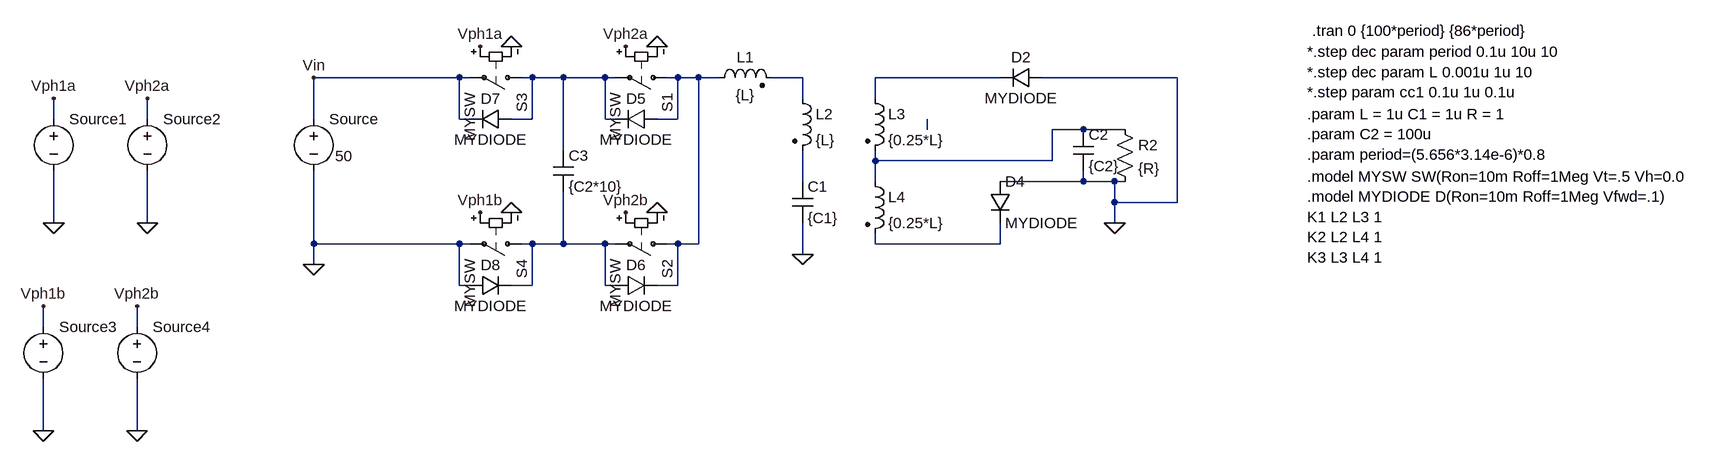
[diagram p0: schematic LLC_multilevel.asc]
LLC_multilevel.asc, the LTspice schematic file:
Version 4
SHEET 1 1688 680
WIRE -448 96 -672 96
WIRE -432 96 -448 96
WIRE -336 96 -352 96
WIRE -288 96 -336 96
WIRE -224 96 -288 96
WIRE -208 96 -224 96
WIRE -112 96 -128 96
WIRE -80 96 -112 96
WIRE -48 96 -80 96
WIRE 80 96 32 96
WIRE 384 96 192 96
WIRE 656 96 448 96
WIRE 80 128 80 96
WIRE 192 128 192 96
WIRE -1072 160 -1072 128
WIRE -928 160 -928 128
WIRE -672 160 -672 96
WIRE -448 160 -448 96
WIRE -432 160 -448 160
WIRE -336 160 -336 96
WIRE -336 160 -368 160
WIRE -224 160 -224 96
WIRE -208 160 -224 160
WIRE -112 160 -112 96
WIRE -112 160 -144 160
WIRE 272 176 272 160
WIRE 512 176 464 176
WIRE 576 176 512 176
WIRE -288 208 -288 96
WIRE 192 224 192 208
WIRE 464 224 464 176
WIRE 464 224 192 224
WIRE 80 256 80 208
WIRE 192 256 192 224
WIRE 512 256 512 240
WIRE 512 256 384 256
WIRE 560 256 512 256
WIRE 576 256 560 256
WIRE 560 288 560 256
WIRE 656 288 656 96
WIRE 656 288 560 288
WIRE -1072 320 -1072 240
WIRE -928 320 -928 240
WIRE 560 320 560 288
WIRE -672 352 -672 240
WIRE -448 352 -672 352
WIRE -432 352 -448 352
WIRE -336 352 -352 352
WIRE -288 352 -288 272
WIRE -288 352 -336 352
WIRE -224 352 -288 352
WIRE -208 352 -224 352
WIRE -112 352 -128 352
WIRE -80 352 -80 96
WIRE -80 352 -112 352
WIRE 192 352 192 336
WIRE 384 352 384 320
WIRE 384 352 192 352
WIRE 80 368 80 320
WIRE -672 384 -672 352
WIRE -448 416 -448 352
WIRE -432 416 -448 416
WIRE -336 416 -336 352
WIRE -336 416 -368 416
WIRE -224 416 -224 352
WIRE -208 416 -224 416
WIRE -112 416 -112 352
WIRE -112 416 -144 416
WIRE -1088 480 -1088 448
WIRE -944 480 -944 448
WIRE -1088 640 -1088 560
WIRE -944 640 -944 560
FLAG 80 368 0
FLAG -672 96 Vin
FLAG 560 320 0
FLAG -1072 320 0
FLAG -1072 128 Vph1a
FLAG -928 128 Vph2a
FLAG -192 48 Vph2a
FLAG -192 304 Vph2b
FLAG -144 48 0
FLAG -144 304 0
FLAG -928 320 0
FLAG -416 48 Vph1a
FLAG -416 304 Vph1b
FLAG -368 48 0
FLAG -368 304 0
FLAG -1088 640 0
FLAG -1088 448 Vph1b
FLAG -944 448 Vph2b
FLAG -944 640 0
FLAG -672 384 0
SYMBOL voltage -672 144 R0
WINDOW 123 0 0 Left 2
WINDOW 39 0 0 Left 2
WINDOW 3 33 73 Left 2
SYMATTR Value 50
SYMATTR InstName Source
SYMBOL cap 64 256 R0
SYMATTR InstName C1
SYMATTR Value {C1}
SYMATTR SpiceLine Rser=1m
SYMBOL ind2 -64 112 R270
WINDOW 0 32 56 VTop 2
WINDOW 3 5 56 VBottom 2
SYMATTR InstName L1
SYMATTR Value {L}
SYMATTR Type ind
SYMBOL ind2 64 112 R0
SYMATTR InstName L2
SYMATTR Value {L}
SYMATTR Type ind
SYMBOL ind2 176 112 R0
SYMATTR InstName L3
SYMATTR Value {0.25*L}
SYMATTR Type ind
SYMBOL res 560 160 R0
SYMATTR InstName R2
SYMATTR Value {R}
SYMBOL diode 448 80 R90
WINDOW 3 32 32 VTop 2
WINDOW 0 0 32 VBottom 2
SYMATTR Value MYDIODE
SYMATTR InstName D2
SYMBOL diode 368 256 R0
SYMATTR InstName D4
SYMATTR Value MYDIODE
SYMBOL cap 496 176 R0
SYMATTR InstName C2
SYMATTR Value {C2}
SYMBOL sw -112 96 R90
SYMATTR InstName S1
SYMATTR Value MYSW
SYMBOL sw -112 352 R90
SYMATTR InstName S2
SYMATTR Value MYSW
SYMBOL voltage -1072 144 R0
WINDOW 123 0 0 Left 2
WINDOW 39 0 0 Left 2
WINDOW 3 -326 126 Invisible 2
SYMATTR Value PULSE(0 1 {10n} 1n 1n {period/4-10n} {period})
SYMATTR InstName Source1
SYMBOL voltage -928 144 R0
WINDOW 123 0 0 Left 2
WINDOW 39 0 0 Left 2
WINDOW 3 -326 126 Invisible 2
SYMATTR Value PULSE(0 1 {period/2+10n} 1n 1n {period/4-10n} {period})
SYMATTR InstName Source2
SYMBOL diode -144 144 R90
WINDOW 0 0 32 VBottom 2
WINDOW 3 32 32 VTop 2
SYMATTR InstName D5
SYMATTR Value MYDIODE
SYMBOL diode -208 432 R270
WINDOW 0 32 32 VTop 2
WINDOW 3 0 32 VBottom 2
SYMATTR InstName D6
SYMATTR Value MYDIODE
SYMBOL sw -336 96 R90
SYMATTR InstName S3
SYMATTR Value MYSW
SYMBOL sw -336 352 R90
SYMATTR InstName S4
SYMATTR Value MYSW
SYMBOL diode -368 144 R90
WINDOW 0 0 32 VBottom 2
WINDOW 3 32 32 VTop 2
SYMATTR InstName D7
SYMATTR Value MYDIODE
SYMBOL diode -432 432 R270
WINDOW 0 32 32 VTop 2
WINDOW 3 0 32 VBottom 2
SYMATTR InstName D8
SYMATTR Value MYDIODE
SYMBOL cap -304 208 R0
SYMATTR InstName C3
SYMATTR Value {C2*10}
SYMATTR SpiceLine Rser=1m
SYMBOL voltage -1088 464 R0
WINDOW 123 0 0 Left 2
WINDOW 39 0 0 Left 2
WINDOW 3 -326 126 Invisible 2
SYMATTR Value PULSE(1 0 0 1n 1n {period/4+10n} {period})
SYMATTR InstName Source3
SYMBOL voltage -944 464 R0
WINDOW 123 0 0 Left 2
WINDOW 39 0 0 Left 2
WINDOW 3 -326 126 Invisible 2
SYMATTR Value PULSE(1 0 {period/2} 1n 1n {period/4+10n} {period})
SYMATTR InstName Source4
SYMBOL ind2 176 240 R0
SYMATTR InstName L4
SYMATTR Value {0.25*L}
SYMATTR Type ind
TEXT 864 24 Left 2 !.tran 0 {100*period} {86*period}
TEXT 856 248 Left 2 !.model MYSW SW(Ron=10m Roff=1Meg Vt=.5 Vh=0.0\n.model MYDIODE D(Ron=10m Roff=1Meg Vfwd=.1)\nK1 L2 L3 1\nK2 L2 L4 1\nK3 L3 L4 1
TEXT 856 56 Left 2 !*.step dec param period 0.1u 10u 10\n*.step dec param L 0.001u 1u 10\n*.step param cc1 0.1u 1u 0.1u
TEXT 856 152 Left 2 !.param L = 1u C1 = 1u R = 1\n.param C2 = 100u\n.param period=(5.656*3.14e-6)*0.8

The netlist it stands for:
* LLC_multilevel.asc
V§Source Vin 0 50
C1 N007 0 {C1} Rser=1m
L1 N002 N003 {L}
L2 N003 N007 {L}
L3 N004 N006 {0.25*L}
R2 N006 0 {R}
D2 0 N004 MYDIODE
D4 0 N009 MYDIODE
C2 N006 0 {C2}
S1 N002 N001 Vph2a 0 MYSW
S2 N002 N008 Vph2b 0 MYSW
V§Source1 Vph1a 0 PULSE(0 1 {10n} 1n 1n {period/4-10n} {period})
V§Source2 Vph2a 0 PULSE(0 1 {period/2+10n} 1n 1n {period/4-10n} {period})
D5 N002 N001 MYDIODE
D6 N008 N002 MYDIODE
S3 N001 Vin Vph1a 0 MYSW
S4 N008 0 Vph1b 0 MYSW
D7 N001 Vin MYDIODE
D8 0 N008 MYDIODE
C3 N001 N008 {C2*10} Rser=1m
V§Source3 Vph1b 0 PULSE(1 0 0 1n 1n {period/4+10n} {period})
V§Source4 Vph2b 0 PULSE(1 0 {period/2} 1n 1n {period/4+10n} {period})
L4 N006 N009 {0.25*L}
.model D D
.lib standard.dio
.tran 0 {100*period} {86*period}
.model MYSW SW(Ron=10m Roff=1Meg Vt=.5 Vh=0.0
.model MYDIODE D(Ron=10m Roff=1Meg Vfwd=.1)
K1 L2 L3 1
K2 L2 L4 1
K3 L3 L4 1
*.step dec param period 0.1u 10u 10
*.step dec param L 0.001u 1u 10
*.step param cc1 0.1u 1u 0.1u
.param L = 1u C1 = 1u R = 1
.param C2 = 100u
.param period=(5.656*3.14e-6)*0.8
.backanno
.end